# EAGLE design shield-jlink (EAGLE 7.6.0)
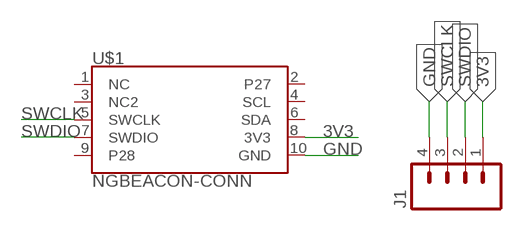
[diagram p0: schematic, sheet 1]

## Parts
J1  M04LOCK  [1X04_LOCK]
U$1  NGBEACON-CONN  [2X5-PTH-1.27MM]

## Nets
3V3: J1.1 U$1.8(3V3)
GND: J1.4 U$1.10(GND)
SWCLK: J1.3 U$1.5(SWCLK)
SWDIO: J1.2 U$1.7(SWDIO)
Unconnected: U$1.1(NC) U$1.2(P27) U$1.3(NC2) U$1.4(SCL) U$1.6(SDA) U$1.9(P28)

## Library data of the parts
J1 = SparkFun-Connectors:M04: Header 4 Standard 4-pin 0.1" header. Use with straight break away headers (SKU : PRT-00116), right angle break away headers (PRT-00553), swiss pins (PRT-00743), machine pins (PRT-00117), and female headers (PRT-00115). Molex polarized connector foot print use with SKU : PRT-08231 with associated crimp pins and housings. 1MM SMD Version SKU: PRT-10208; PROD_ID: CONN-09696
U$1 = ng-beacon:NGBEACON-CONN

## Board
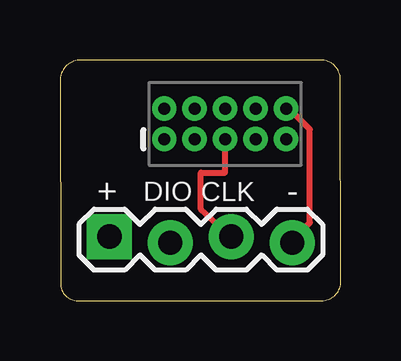
[diagram p1: board, top side]
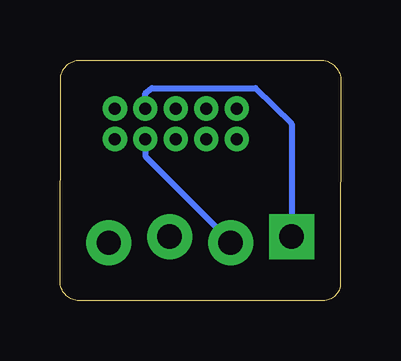
[diagram p2: board, bottom side, seen from below]

Size 11.71 x 10.03 mm. Coordinates in mm from the lower left corner, seen from the top.
Outline: 11.71,0.8 11.68,9.2 arc90 10.86,10.03 0.87,10.03 arc90 0,9.15 0.02,0.72 arc90 0.74,0 10.9,0 arc90 11.71,0.8
Copper layers (1*16): Top 0.035mm / dielectric 1.5mm / Bottom 0.035mm
Design rules "default": minimum track width 10mil, minimum drill 24mil, track to track 8mil, track to pad 8mil, pad to pad 8mil, via to via 8mil, smd to smd 8mil, copper to edge 40mil, drill to drill 8mil, minimum pad ring 10mil, minimum via ring 8mil, stop-mask expansion 4mil, vias tented up to drill 0mil, thermal gap 10mil

### Footprints (pad centres in the part's own frame; a part is rotated, then mirrored left to right if it is on the bottom)
1X04_LOCK = drill 1.016 pad 1.88 square: 1 0,0.127 | drill 1.016 pad 1.88: 2 2.54,-0.127; 3 5.08,0.127; 4 7.62,-0.127
2X5-PTH-1.27MM = drill 0.508 pad 1: 1 -2.54,-0.635; 2 -2.54,0.635; 3 -1.27,-0.635; 4 -1.27,0.635; 5 0,-0.635; 6 0,0.635; 7 1.27,-0.635; 8 1.27,0.635; 9 2.54,-0.635; 10 2.54,0.635

### Placement (x,y rotation side)
J1  2.06,2.54 0 top
U$1  6.88,7.37 0 top

### Tracks (layer width: path | path; a pad name or v marks a point on that pad's centre or on a via)
3V3
  Bottom 0.254: U$1.8 8.15,8.64 7.88,8.85 3.56,8.85 2.06,7.37 J1.1
GND
  Top 0.254: U$1.10 9.5,7.82 9.73,7.82 10.41,7.14 10.41,3.25 9.73,2.56 J1.4
SWCLK
  Top 0.254: U$1.5 6.98,6.68 6.88,6.68 6.88,5.33 5.87,5.33 5.87,3.81 6.98,2.79 J1.3
SWDIO
  Bottom 0.254: U$1.7 8.13,6.68 8.13,5.99 4.7,2.56 J1.2

### Text on the board
tNames: DIO | CLK | + | -